# Altium schematic sheet EDU_High-Speed-Design_CPU_SPI_I2C.SchDoc: CPU SPI I2C
size 279 x 215 mm; Date: not used; ApprovedBy: not used; CheckedBy: not used; Author: not used; DrawnBy: not used; Organization: not used; Address4: not used; SheetNumber: 17; SheetTotal: 27; Time: not used; ImagePath: not used; Application_BuildNumber: not used
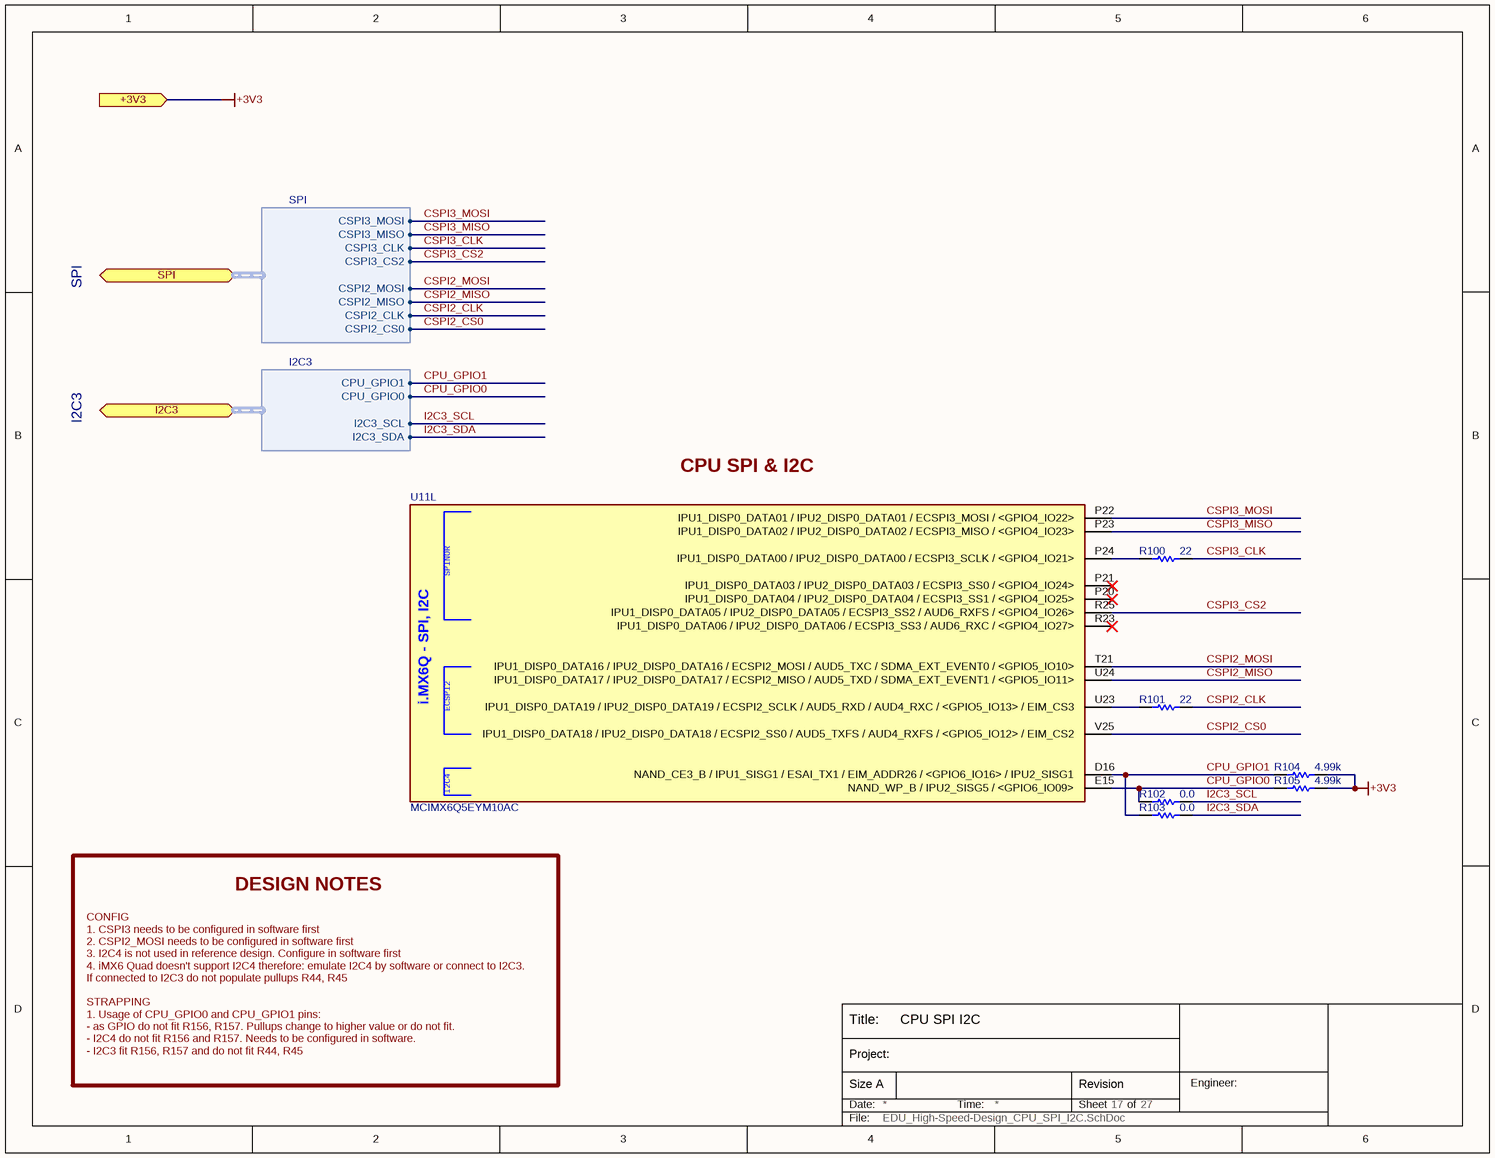
[diagram p0: EDU_High-Speed-Design_CPU_SPI_I2C.SchDoc]

## Parts
R100  22  [R0402]
R101  22  [R0402]
R102  0.0  [R0402]
R103  0.0  [R0402]
R104  4.99k  [R0402]
R105  4.99k  [R0402]
U11  MCIMX6Q5EYM10AC  [MCIMX6Q5EYM10AC]  (part L of 15)

## Ports
+3V3 (in), I2C3 (bidir, harness I2C3), SPI (bidir, harness SPI)

## Harnesses
SPI: CSPI3_MOSI, CSPI3_MISO, CSPI3_CLK, CSPI3_CS2, CSPI2_MOSI, CSPI2_MISO, CSPI2_CLK, CSPI2_CS0
I2C3: CPU_GPIO0, I2C3_SCL, CPU_GPIO1, I2C3_SDA

## Nets
+3V3: R104.1 R105.1 ; port +3V3
CPU_GPIO0: R102.2 R105.2 U11.E15(NAND_WP_B_/_IPU2_SISG5_/_<GPIO6_IO09>) ; port I2C3.CPU_GPIO0
CPU_GPIO1: R103.2 R104.2 U11.D16(NAND_CE3_B_/_IPU1_SISG1_/_ESAI_TX1_/_EIM_ADDR26_/_<GPIO6_IO16>_/_IPU2_SISG1) ; port I2C3.CPU_GPIO1
CSPI2_CLK: R101.1 ; port SPI.CSPI2_CLK
CSPI2_CS0: U11.V25(IPU1_DISP0_DATA18_/_IPU2_DISP0_DATA18_/_ECSPI2_SS0_/_AUD5_TXFS_/_AUD4_RXFS_/_<GPIO5_IO12>_/_EIM_CS2) ; port SPI.CSPI2_CS0
CSPI2_MISO: U11.U24(IPU1_DISP0_DATA17_/_IPU2_DISP0_DATA17_/_ECSPI2_MISO_/_AUD5_TXD_/_SDMA_EXT_EVENT1_/_<GPIO5_IO11>) ; port SPI.CSPI2_MISO
CSPI2_MOSI: U11.T21(IPU1_DISP0_DATA16_/_IPU2_DISP0_DATA16_/_ECSPI2_MOSI_/_AUD5_TXC_/_SDMA_EXT_EVENT0_/_<GPIO5_IO10>) ; port SPI.CSPI2_MOSI
CSPI3_CLK: R100.1 ; port SPI.CSPI3_CLK
CSPI3_CS2: U11.R25(IPU1_DISP0_DATA05_/_IPU2_DISP0_DATA05_/_ECSPI3_SS2_/_AUD6_RXFS_/_<GPIO4_IO26>) ; port SPI.CSPI3_CS2
CSPI3_MISO: U11.P23(IPU1_DISP0_DATA02_/_IPU2_DISP0_DATA02_/_ECSPI3_MISO_/_<GPIO4_IO23>) ; port SPI.CSPI3_MISO
CSPI3_MOSI: U11.P22(IPU1_DISP0_DATA01_/_IPU2_DISP0_DATA01_/_ECSPI3_MOSI_/_<GPIO4_IO22>) ; port SPI.CSPI3_MOSI
I2C3_SCL: R102.1 ; port I2C3.I2C3_SCL
I2C3_SDA: R103.1 ; port I2C3.I2C3_SDA
NetR100_2: R100.2 U11.P24(IPU1_DISP0_DATA00_/_IPU2_DISP0_DATA00_/_ECSPI3_SCLK_/_<GPIO4_IO21>)
NetR101_2: R101.2 U11.U23(IPU1_DISP0_DATA19_/_IPU2_DISP0_DATA19_/_ECSPI2_SCLK_/_AUD5_RXD_/_AUD4_RXC_/_<GPIO5_IO13>_/_EIM_CS3)

Not connected (* = marked no-connect by the designer): U11 P20(IPU1_DISP0_DATA04_/_IPU2_DISP0_DATA04_/_ECSPI3_SS1_/_<GPIO4_IO25>)* P21(IPU1_DISP0_DATA03_/_IPU2_DISP0_DATA03_/_ECSPI3_SS0_/_<GPIO4_IO24>)* R23(IPU1_DISP0_DATA06_/_IPU2_DISP0_DATA06_/_ECSPI3_SS3_/_AUD6_RXC_/_<GPIO4_IO27>)*

## Notes on the sheet
- SPI
- I2C3
- CPU SPI & I2C
- DESIGN NOTES
- CONFIG
  1. CSPI3 needs to be configured in software first
  2. CSPI2_MOSI needs to be configured in software first
  3. I2C4 is not used in reference design. Configure in software first
  4. iMX6 Quad doesn't support I2C4 therefore: emulate I2C4 by software or connect to I2C3.
  If connected to I2C3 do not populate pullups R44, R45
  STRAPPING
  1. Usage of CPU_GPIO0 and CPU_GPIO1 pins:
  - as GPIO do not fit R156, R157. Pullups change to higher value or do not fit.
  - I2C4 do not fit R156 and R157. Needs to be configured in software.
  - I2C3 fit R156, R157 and do not fit R44, R45
- Title:
- Date:
- Size A
- Project:
- Time:
- Sheet
- Revision
- of
- Engineer:
- File:
- (in symbol MCIMX6Q5EYM10AC, part L) SPINOR; i.MX6Q - SPI, I2C; ECSPI2; I2C4

## Library data of the parts
R100 R101 = RC0402FR-0722RL: RES 22.0 OHM 1/16W 1% 0402 SMD; Manufacturer 1: Yageo; Manufacturer Part Number 1: RC0402FR-0722RL; Resistance: 22; Supplier 1: Digi-Key; Supplier Part Number 1: 311-22.0LRCT-ND; ComponentLink1URL: http://www.yageo.com/documents/recent/PYu-RC0402_51_RoHS_L_6.pdf; ComponentLink1Description: http://www.yageo.com/documents/recent/PYu-RC0402_51_RoHS_L_6.pdf
R102 R103 = RC0402JR-070RL: RES 0.0 OHM 1/16W 0402 SMD; Manufacturer 1: Yageo; Manufacturer Part Number 1: RC0402JR-070RL; Resistance: 0.0; Supplier 1: Digi-Key; Supplier Part Number 1: 311-0.0JRCT-ND; ComponentLink1URL: http://www.yageo.com/documents/recent/PYu-RC0402_51_RoHS_L_6.pdf; ComponentLink1Description: http://www.yageo.com/documents/recent/PYu-RC0402_51_RoHS_L_6.pdf
R104 R105 = RMCF0402FT4K99: RES TF 4.99K OHM 1% 1/16W 0402; Manufacturer 1: Stackpole Electronics Inc; Manufacturer Part Number 1: RMCF0402FT4K99; Resistance: 4.99k; Supplier 1: Digi-Key; Supplier Part Number 1: RMCF0402FT4K99CT-ND; ComponentLink1URL: http://www.seielect.com/Catalog/SEI-RMCF.pdf; ComponentLink1Description: http://www.seielect.com/Catalog/SEI-RMCF.pdf
U11 = MCIMX6Q5EYM10AC: IC MCU 32BIT ARM QUAD 624FCBGA; Manufacturer 1: Freescale Semiconductor; Supplier 1: Digi-Key; Manufacturer Part Number 1: MCIMX6Q5EYM10AC; Supplier Part Number 1: MCIMX6Q5EYM10AC-ND